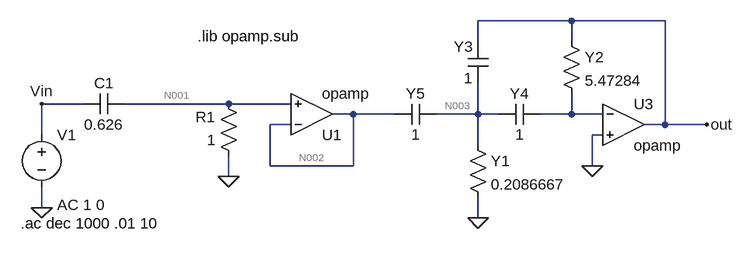
[diagram p0: schematic 26TS_3_mfb.asc]
26TS_3_mfb.asc, the LTspice schematic file:
Version 4.1
SHEET 1 1396 680
WIRE 624 -48 480 -48
WIRE 768 -48 624 -48
WIRE 480 -16 480 -48
WIRE 624 -16 624 -48
WIRE -128 80 -192 80
WIRE 96 80 -64 80
WIRE 192 80 96 80
WIRE 288 96 256 96
WIRE 352 96 288 96
WIRE 480 96 480 48
WIRE 480 96 416 96
WIRE 512 96 480 96
WIRE 624 96 624 64
WIRE 624 96 576 96
WIRE 672 96 624 96
WIRE 192 112 160 112
WIRE 768 112 768 -48
WIRE 768 112 736 112
WIRE 832 112 768 112
WIRE -192 128 -192 80
WIRE 672 128 656 128
WIRE 480 144 480 96
WIRE 160 176 160 112
WIRE 288 176 288 96
WIRE 288 176 160 176
WIRE 656 176 656 128
WIRE 96 192 96 160
WIRE -192 240 -192 208
WIRE 480 256 480 224
FLAG 96 192 0
FLAG -192 240 0
FLAG -192 80 Vin
FLAG 832 112 out
FLAG 656 176 0
FLAG 480 256 0
SYMBOL cap -64 64 R90
WINDOW 0 0 32 VBottom 2
WINDOW 3 32 32 VTop 2
SYMATTR InstName C1
SYMATTR Value 0.626
SYMBOL res 112 176 R180
WINDOW 0 36 76 Left 2
WINDOW 3 36 40 Left 2
SYMATTR InstName R1
SYMATTR Value 1
SYMBOL OpAmps\\opamp 224 160 M180
SYMATTR InstName U1
SYMBOL voltage -192 112 R0
WINDOW 123 24 124 Left 2
WINDOW 39 0 0 Left 0
SYMATTR Value2 AC 1 0
SYMATTR InstName V1
SYMATTR Value ""
SYMBOL OpAmps\\opamp 704 48 R0
SYMATTR InstName U3
SYMBOL cap 416 80 R90
WINDOW 0 0 32 VBottom 2
WINDOW 3 32 32 VTop 2
SYMATTR InstName Y5
SYMATTR Value 1
SYMBOL cap 496 48 R180
WINDOW 0 24 56 Left 2
WINDOW 3 24 8 Left 2
SYMATTR InstName Y3
SYMATTR Value 1
SYMBOL cap 512 112 R270
WINDOW 0 32 32 VTop 2
WINDOW 3 0 32 VBottom 2
SYMATTR InstName Y4
SYMATTR Value 1
SYMBOL res 464 128 R0
SYMATTR InstName Y1
SYMATTR Value 0.2086667
SYMBOL res 608 -32 R0
SYMATTR InstName Y2
SYMATTR Value 5.47284
TEXT -224 264 Left 2 !.ac dec 1000 .01 10
TEXT 48 -24 Left 2 !.lib opamp.sub

The netlist it stands for:
* 26TS_3_mfb.asc
C1 N001 Vin 0.626
R1 0 N001 1
X§U1 N002 N001 N002 opamp Aol=100K GBW=10Meg  ; pins invin noninvin out
V1 Vin 0 AC 1 0
X§U3 N004 0 out opamp Aol=100K GBW=10Meg  ; pins invin noninvin out
C§Y5 N003 N002 1
C§Y3 N003 out 1
C§Y4 N003 N004 1
R§Y1 N003 0 0.2086667
R§Y2 out N004 5.47284
.ac dec 1000 .01 10
.lib opamp.sub
.backanno
.end

* Results of the author's LTspice run, read from the files saved beside the schematic
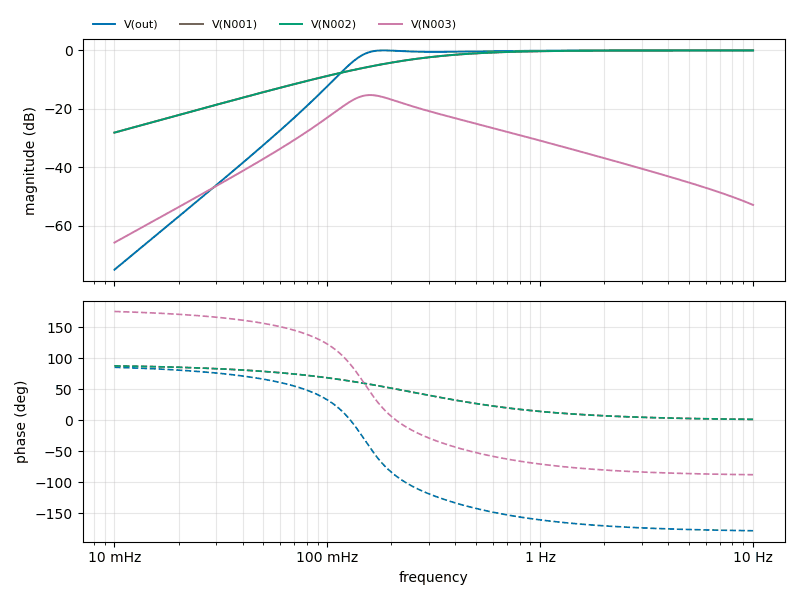
[diagram p1: AC Analysis of 26TS_3_mfb.asc, plotted from the saved traces]
* AC Analysis, 1 run:
*   V(out): -75.00 dB at 10 mHz, -0.00 dB at 10 Hz, peak -0.00 dB at 183.7 mHz, 3 dB below the peak at 136.3 mHz
*   V(N001): -28.11 dB at 10 mHz, -0.00 dB at 10 Hz, peak -0.00 dB at 10 Hz, 3 dB below the peak at 254.1 mHz
*   V(N002): -28.11 dB at 10 mHz, -0.00 dB at 10 Hz, peak -0.00 dB at 10 Hz, 3 dB below the peak at 254.1 mHz
*   V(N003): -65.73 dB at 10 mHz, -52.85 dB at 10 Hz, peak -15.27 dB at 158.9 mHz, 3 dB below the peak at 123.3 mHz and 230.5 mHz